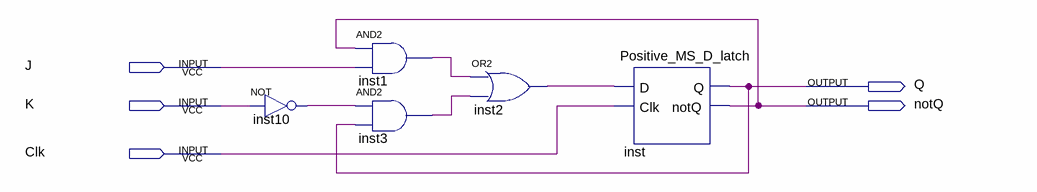
[diagram p0: schematic sheet]
// Quartus schematic JK_ff.bdf as structural Verilog: 5 symbols, 5 pins
module JK_ff (
  input  J,
  input  K,
  input  Clk,
  output Q,
  output notQ
);

  wire inst1_out, inst2_out, inst3_out, inst10_out;

  not inst10 (inst10_out, K);
  and inst1 (inst1_out, notQ, J);
  and inst3 (inst3_out, inst10_out, Q);
  or inst2 (inst2_out, inst1_out, inst3_out);
  Positive_MS_D_latch inst (.D(inst2_out), .Clk(Clk), .Q(Q), .notQ(notQ));
endmodule
